# Altium schematic sheet RTM_POWER_SUPPLY.SchDoc: Sayma RTM
size 420 x 297 mm; $$Internal___BlkDate: 23:43:25_12-13-18; $$Internal_NAME_PLACEHOLDER: a3sheet; $$Internal_Resolution: 00001mm; $$NotCommonProperty_@NAME: RTM_POWER_SUPPLY; $$NotCommonProperty_@PRINTORDER: 16; $$NotCommonProperty_@SHEET: 1; $$NotCommonProperty_@SHEETTOTAL: 16; $$NotCommonProperty_FORWARD_PCB: 0; CmpIndex: 8; Drawing Author: G.Kasprowicz; Drawing Number: Sayma RTM; Drawing Project: 8 channel SAWG; Drawing Revision: 2.0; SymIndex: 2227; Author: G.Kasprowicz; CompanyName: WUT ISE; DrawnBy: G.Kasprowicz; Organization: WUT ISE; Address1: PW ISE; Address2: Nowowiejska 15/19 00-665 Warsaw; Address3: gkasprow@gmail.com; DocumentNumber: 11; Revision: 1.0; SheetNumber: 11; SheetTotal: 18; ModifiedBy: -; CheckedDate: -; Title2: RTM power management; DivGrp: WUT ISE; Designer: G.Kasprowicz; ModifiedDate: -; ProjectName: Sensor Box
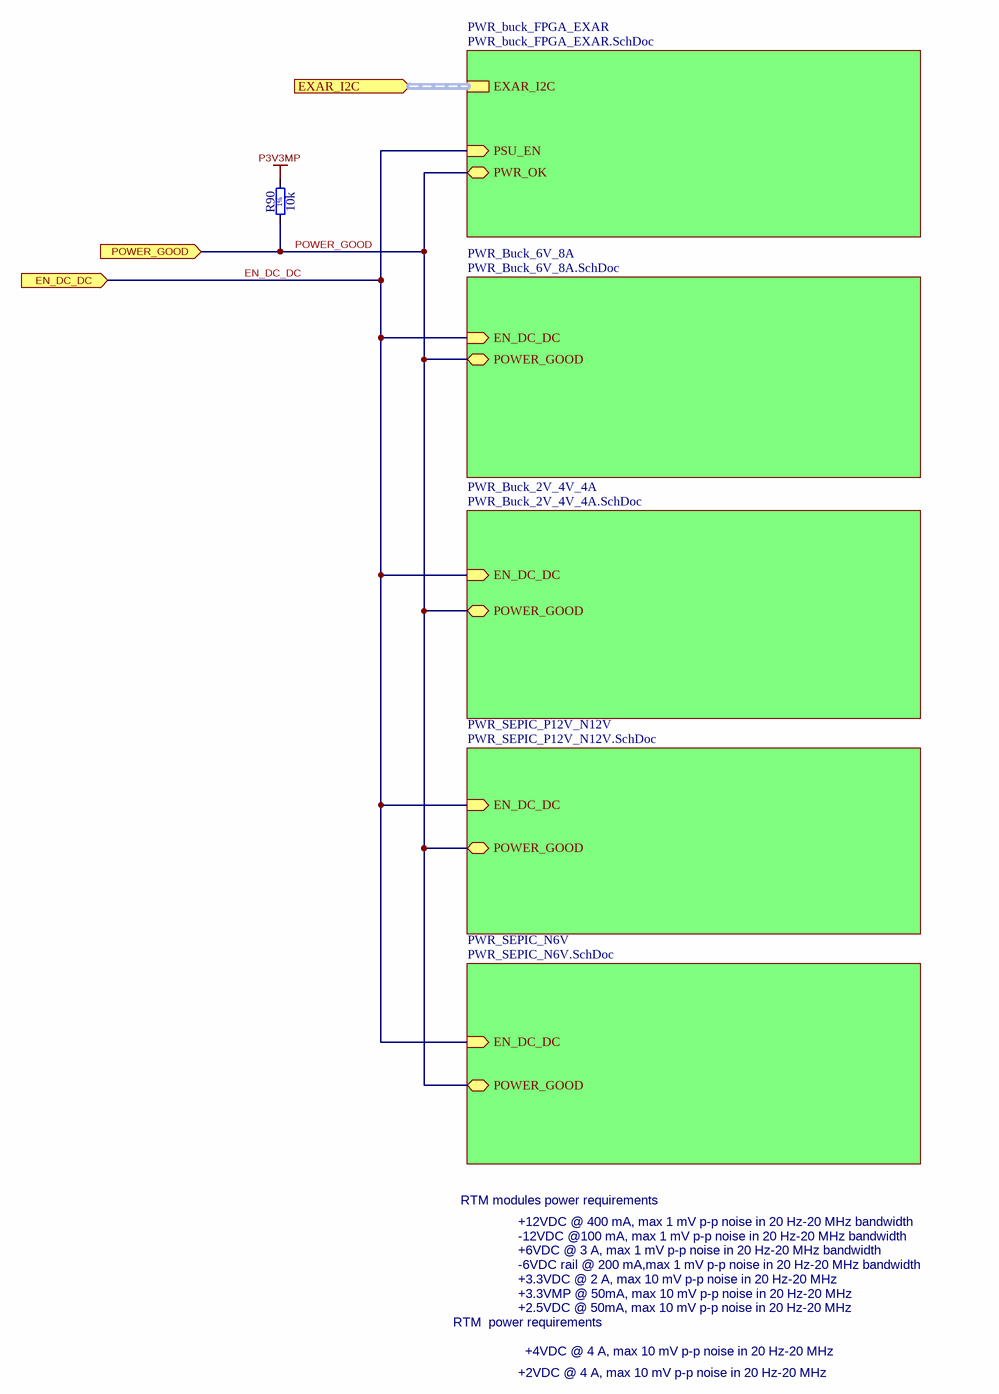
[diagram p0: RTM_POWER_SUPPLY.SchDoc]

## Parts
R90  10k  [RESC1005X40N]

## Sub-sheets
PWR_Buck_2V_4V_4A = PWR_Buck_2V_4V_4A.SchDoc: EN_DC_DC (in), POWER_GOOD (bidir)  | CmpIndex: 3; Name: PWR_Buck_2V_4V_4A; SymIndex: 1484
PWR_Buck_6V_8A = PWR_Buck_6V_8A.SchDoc: POWER_GOOD (bidir), EN_DC_DC (in)  | CmpIndex: 2; Name: PWR_Buck_6V_8A; SymIndex: 1485
PWR_buck_FPGA_EXAR = PWR_buck_FPGA_EXAR.SchDoc: PWR_OK (bidir), PSU_EN (in), EXAR_I2C (harness I2C)  | CmpIndex: 1; Name: EXAR; SymIndex: 1780
PWR_SEPIC_N6V = PWR_SEPIC_N6V.SchDoc: POWER_GOOD (bidir), EN_DC_DC (in)  | CmpIndex: 21; Name: PWR_SEPIC_N6V; SymIndex: 1492
PWR_SEPIC_P12V_N12V = PWR_SEPIC_P12V_N12V.SchDoc: POWER_GOOD (bidir), EN_DC_DC (in)  | CmpIndex: 17; Name: PWR_SEPIC_P12V_N12V; SymIndex: 1488

## Ports
EN_DC_DC (in), EXAR_I2C (in, harness I2C), POWER_GOOD (in)

## Nets
P3V3MP: R90.2
EN_DC_DC: port EN_DC_DC, sheet PWR_SEPIC_N6V/EN_DC_DC, sheet PWR_SEPIC_P12V_N12V/EN_DC_DC, sheet PWR_Buck_2V_4V_4A/EN_DC_DC, sheet PWR_Buck_6V_8A/EN_DC_DC, sheet PWR_buck_FPGA_EXAR/PSU_EN
POWER_GOOD: R90.1 ; port POWER_GOOD, sheet PWR_SEPIC_N6V/POWER_GOOD, sheet PWR_SEPIC_P12V_N12V/POWER_GOOD, sheet PWR_Buck_2V_4V_4A/POWER_GOOD, sheet PWR_Buck_6V_8A/POWER_GOOD, sheet PWR_buck_FPGA_EXAR/PWR_OK

## Buses and harness runs
harness port EXAR_I2C = sheet PWR_buck_FPGA_EXAR/EXAR_I2C

## Notes on the sheet
- RTM modules power requirements
- +12VDC @ 400 mA, max 1 mV p-p noise in 20 Hz-20 MHz bandwidth
- -12VDC @100 mA, max 1 mV p-p noise in 20 Hz-20 MHz bandwidth
- +6VDC @ 3 A, max 1 mV p-p noise in 20 Hz-20 MHz bandwidth
- -6VDC rail @ 200 mA,max 1 mV p-p noise in 20 Hz-20 MHz bandwidth
- +3.3VDC @ 2 A, max 10 mV p-p noise in 20 Hz-20 MHz
- +3.3VMP @ 50mA, max 10 mV p-p noise in 20 Hz-20 MHz
- RTM  power requirements
- +2.5VDC @ 50mA, max 10 mV p-p noise in 20 Hz-20 MHz
- +2VDC @ 4 A, max 10 mV p-p noise in 20 Hz-20 MHz
- +4VDC @ 4 A, max 10 mV p-p noise in 20 Hz-20 MHz
- Project/Equipment
- Document
- Designer
- Drawn by
- Check.by
- Copyright WUT ISE 2018.
  This documentation describes Open Hardware and is licensed under the CERN OHL v.1.1. You may redistribute and modify this documentation under the terms of the CERN OHL v.1.1. (http://ohwr.org/CERNOHL). This documentation is distributed WITHOUT ANY EXPRESS OR IMPLIED WARRANTY, INCLUDING OF MERCHANTABILITY, SATISFACTORY QUALITY AND FITNESS FOR A PARTICULAR PURPOSE. Please see the CERN OHL v.1.1 for applicable conditions.
- Contact
- File
- Last Mod.
- Print Date
- Sheet
- Size
- A3
- of
- Rev
- (in symbol R0402_10K_1%_0.0625W_100PPM) 1%

## Library data of the parts
R90 = R0402_10K_1%_0.0625W_100PPM: Resistor - 1%; Manufacturer: GENERIC; Manufacturer1 Part Number: 232270671003L; Part Description: General Purpose Thick Film Chip Resistor; TC: ±100ppm/°C; PressFit: No; Case: 0402; Manufacturer Part Number: R0402_10K_1%_0.0625W_100PPM; Manufacturer1 ComponentHeight: 0.4mm; Manufacturer1 Example: YAGEO PHYCOMP; Part Number: R0402_10K_1%_0.0625W_100PPM; Pin Count: 2; Power: 0.0625W; Sense: No; SMD: Yes; Status: Not Recommended; Tolerance: ±1%; Value: 10k; Component Kind: Standard; Component Type: Standard; Mounted: Yes; Socket: No; HelpURL: \\cern.ch\dfs\Applications\Altium\Datasheets\R0402_Phycomp_RC0402.pdf; Author: CERN DEM JLC; CreateDate: 03.12.2007; LatestRevisionDate: 17.10.2012